# EAGLE design ADCModule (EAGLE 6.5.0)

## Sheet 1 of 3
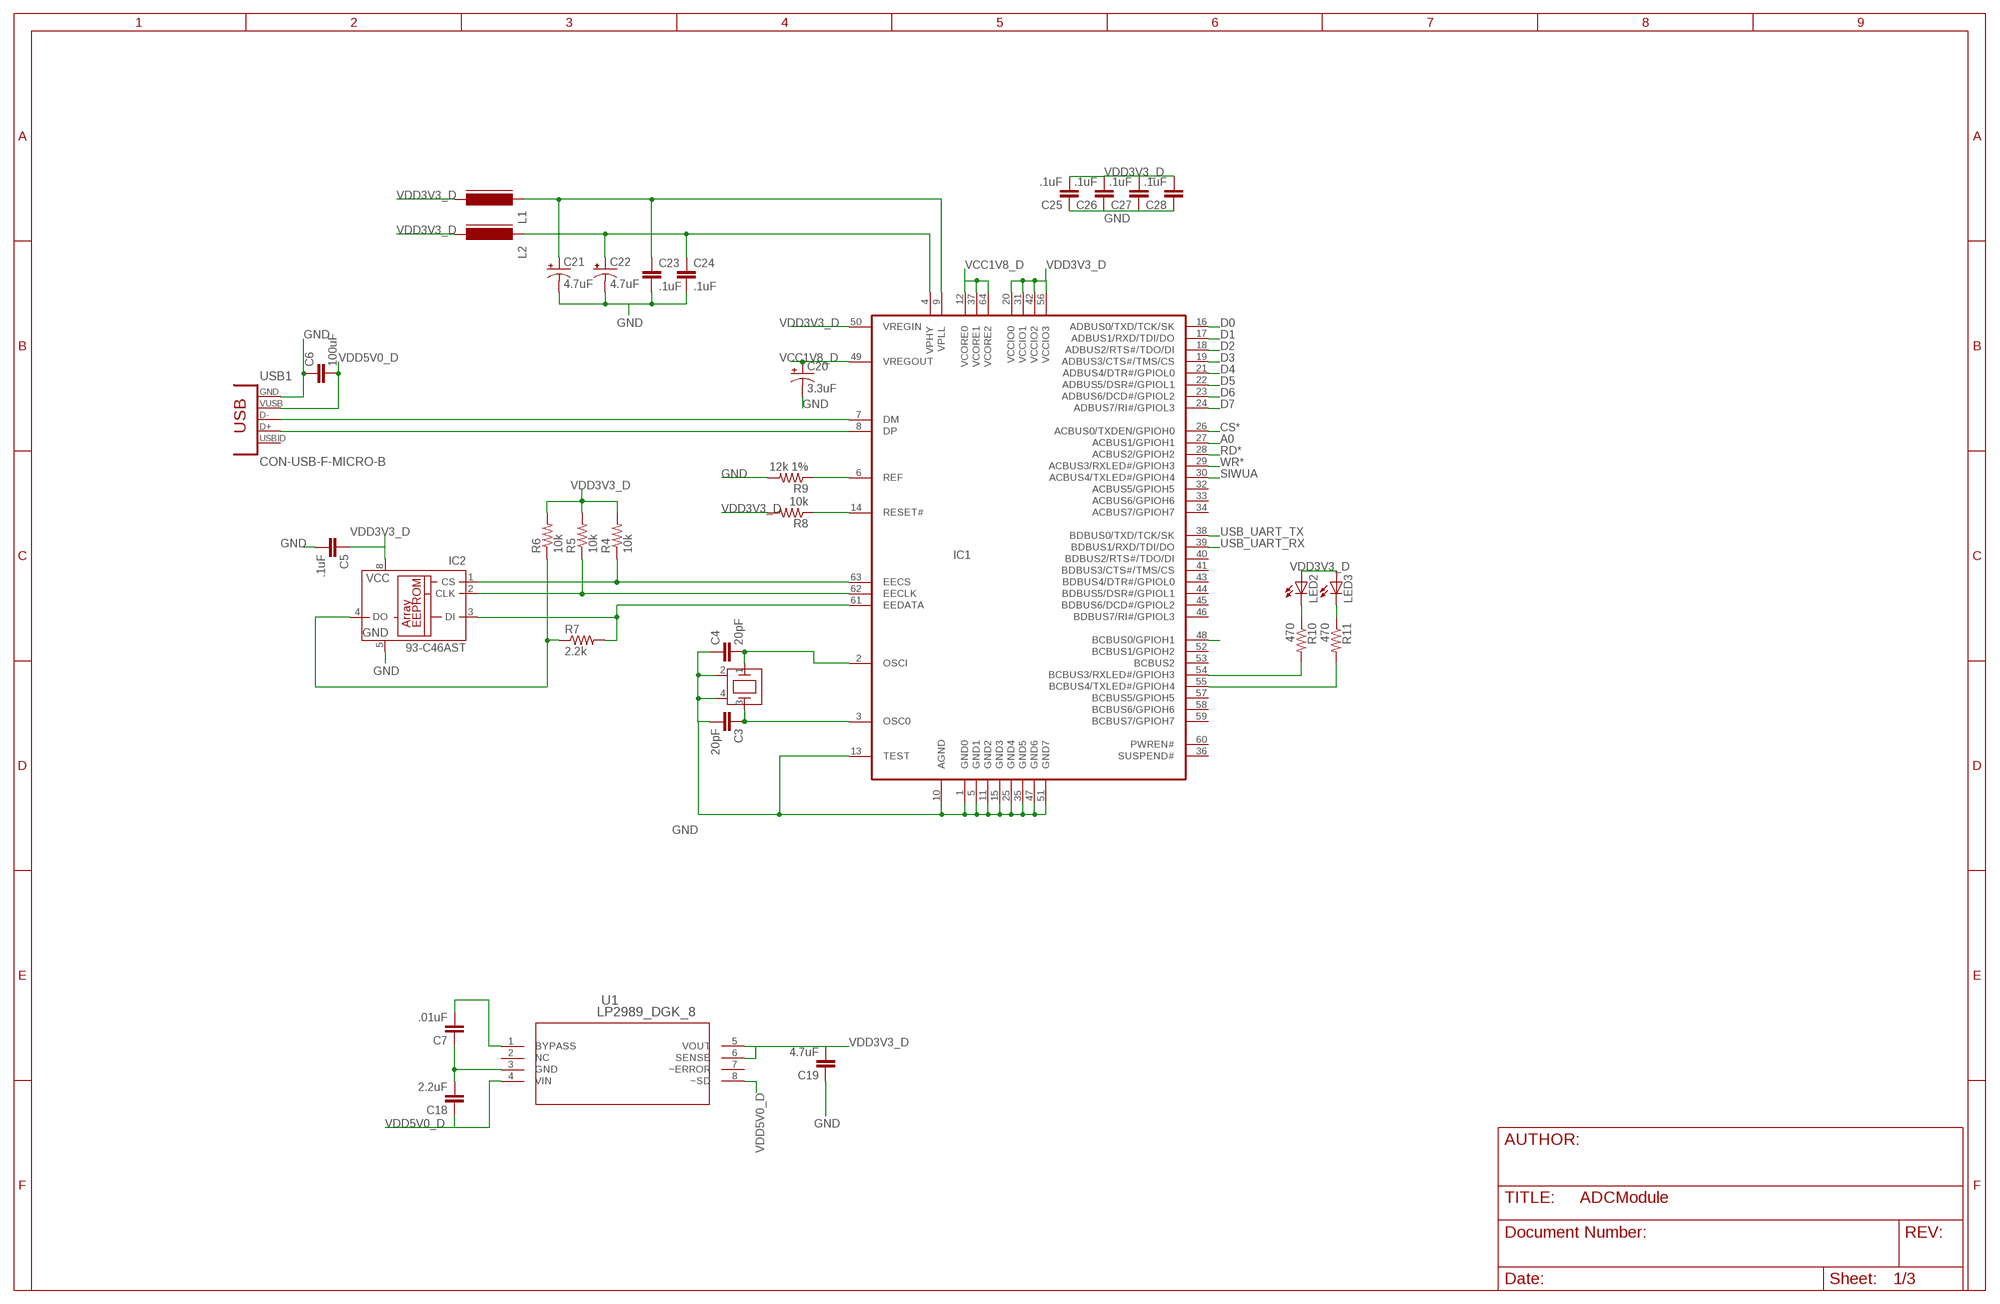
[diagram p0: schematic, sheet 1]

### Parts
C3  20pF  CAP0805  [0805]
C4  20pF  CAP0805  [0805]
C5  .1uF  CAP0805  [0805]
C6  100uF  CAP1206  [1206]
C7  .01uF  CAP0805  [0805]
C18  2.2uF  CAP0805  [0805]
C19  4.7uF  CAP0805  [0805]
C20  3.3uF  CAP_POL1206  [EIA3216]
C21  4.7uF  CAP_POL1206  [EIA3216]
C22  4.7uF  CAP_POL1206  [EIA3216]
C23  .1uF  CAP0805  [0805]
C24  .1uF  CAP0805  [0805]
C25  .1uF  CAP0805  [0805]
C26  .1uF  CAP0805  [0805]
C27  .1uF  CAP0805  [0805]
C28  .1uF  CAP0805  [0805]
IC1  IC_FT2232H  [LQFP64]
IC2  93-C46AST  [TSSOP8]
L1  FERRITE-0805  [FB805]
L2  FERRITE-0805  [FB805]
LED2  LEDCHIP-LED0805  [CHIP-LED0805]
LED3  LEDCHIP-LED0805  [CHIP-LED0805]
R4  10k  RESISTOR0805-RES  [0805]
R5  10k  RESISTOR0805-RES  [0805]
R6  10k  RESISTOR0805-RES  [0805]
R7  2.2k  RESISTOR0805-RES  [0805]
R8  10k  RESISTOR0805-RES  [0805]
R9  12k 1%  RESISTOR0805-RES  [0805]
R10  470  RESISTOR0805-RES  [0805]
R11  470  RESISTOR0805-RES  [0805]
U1  LP2989_DGK_8  [MUA08A]
U$3  7M-12.000MEEQ-T  [7M-CRYSTAL]
USB1  CON-USB-F-MICRO-B  [CONN_USB_MICRO-B]

### Nets
A0: IC1.27(ACBUS1/GPIOH1) ; also sheet 2
CS*: IC1.26(ACBUS0/TXDEN/GPIOH0) ; also sheet 2
D0: IC1.16(ADBUS0/TXD/TCK/SK) ; also sheet 2
D1: IC1.17(ADBUS1/RXD/TDI/DO) ; also sheet 2
D2: IC1.18(ADBUS2/RTS#/TDO/DI) ; also sheet 2
D3: IC1.19(ADBUS3/CTS#/TMS/CS) ; also sheet 2
D4: IC1.21(ADBUS4/DTR#/GPIOL0) ; also sheet 2
D5: IC1.22(ADBUS5/DSR#/GPIOL1) ; also sheet 2
D6: IC1.23(ADBUS6/DCD#/GPIOL2) ; also sheet 2
D7: IC1.24(ADBUS7/RI#/GPIOL3) ; also sheet 2
GND: C3.2 C4.1 C5.2 C6.1 C7.1 C18.2 C19.1 C20.C(-) C21.C(-) C22.C(-) C23.2 C24.2 C25.1 C26.1 C27.1 C28.1 IC1.1(GND0) IC1.5(GND1) IC1.10(AGND) IC1.11(GND2) IC1.13(TEST) IC1.15(GND3) IC1.25(GND4) IC1.35(GND5) IC1.47(GND6) IC1.51(GND7) IC2.5(GND) R9.2 U1.3(GND) U$3.2(GND1) U$3.4(GND2) USB1.P5(GND) ; also sheet 2
N$8: C3.1 IC1.3(OSC0) U$3.3(OSC2)
N$9: C4.2 IC1.2(OSCI) U$3.1(OSC1)
N$10: IC1.7(DM) USB1.P2(D-)
N$11: IC1.8(DP) USB1.P3(D+)
N$12: IC1.63(EECS) IC2.1(CS) R4.1
N$13: IC1.62(EECLK) IC2.2(CLK) R5.1
N$17: IC2.4(DO) R6.1 R7.1
N$18: IC1.61(EEDATA) IC2.3(DI) R7.2
N$19: IC1.14(RESET#) R8.1
N$20: IC1.6(REF) R9.1
N$21: C22.A(+) C24.1 IC1.4(VPHY) L2.1
N$22: C21.A(+) C23.1 IC1.9(VPLL) L1.1
N$23: C7.2 U1.1(BYPASS)
N$27: IC1.48(BCBUS0/GPIOH1)
N$28: IC1.54(BCBUS3/RXLED#/GPIOH3) R10.2
N$29: IC1.55(BCBUS4/TXLED#/GPIOH4) R11.2
N$32: LED2.C R10.1
N$33: LED3.C R11.1
RD*: IC1.28(ACBUS2/GPIOH2) ; also sheet 2
SIWUA: IC1.30(ACBUS4/TXLED#/GPIOH4)
USB_UART_RX: IC1.39(BDBUS1/RXD/TDI/DO) ; also sheet 2
USB_UART_TX: IC1.38(BDBUS0/TXD/TCK/SK) ; also sheet 2
VCC1V8_D: C20.A(+) IC1.12(VCORE0) IC1.37(VCORE1) IC1.49(VREGOUT) IC1.64(VCORE2)
VDD3V3_D: C5.1 C19.2 C25.2 C26.2 C27.2 C28.2 IC1.20(VCCIO0) IC1.31(VCCIO1) IC1.42(VCCIO2) IC1.50(VREGIN) IC1.56(VCCIO3) IC2.8(VCC) L1.2 L2.2 LED2.A LED3.A R4.2 R5.2 R6.2 R8.2 U1.5(VOUT) U1.6(SENSE) ; also sheet 2
VDD5V0_D: C6.2 C18.1 U1.4(VIN) U1.8(~SD) USB1.P1(VUSB) ; also sheet 2
WR*: IC1.29(ACBUS3/RXLED#/GPIOH3) ; also sheet 2
Unconnected: IC1.32(ACBUS5/GPIOH5) IC1.33(ACBUS6/GPIOH6) IC1.34(ACBUS7/GPIOH7) IC1.36(SUSPEND#) IC1.40(BDBUS2/RTS#/TDO/DI) IC1.41(BDBUS3/CTS#/TMS/CS) IC1.43(BDBUS4/DTR#/GPIOL0) IC1.44(BDBUS5/DSR#/GPIOL1) IC1.45(BDBUS6/DCD#/GPIOL2) IC1.46(BDBUS7/RI#/GPIOL3) IC1.52(BCBUS1/GPIOH2) IC1.53(BCBUS2) IC1.57(BCBUS5/GPIOH5) IC1.58(BCBUS6/GPIOH6) IC1.59(BCBUS7/GPIOH7) IC1.60(PWREN#) U1.2(NC) U1.7(~ERROR) USB1.BODY@1(BODY) USB1.BODY@2(BODY) USB1.BODY@3(BODY) USB1.BODY@4(BODY) USB1.P4(USBID)

## Sheet 2 of 3
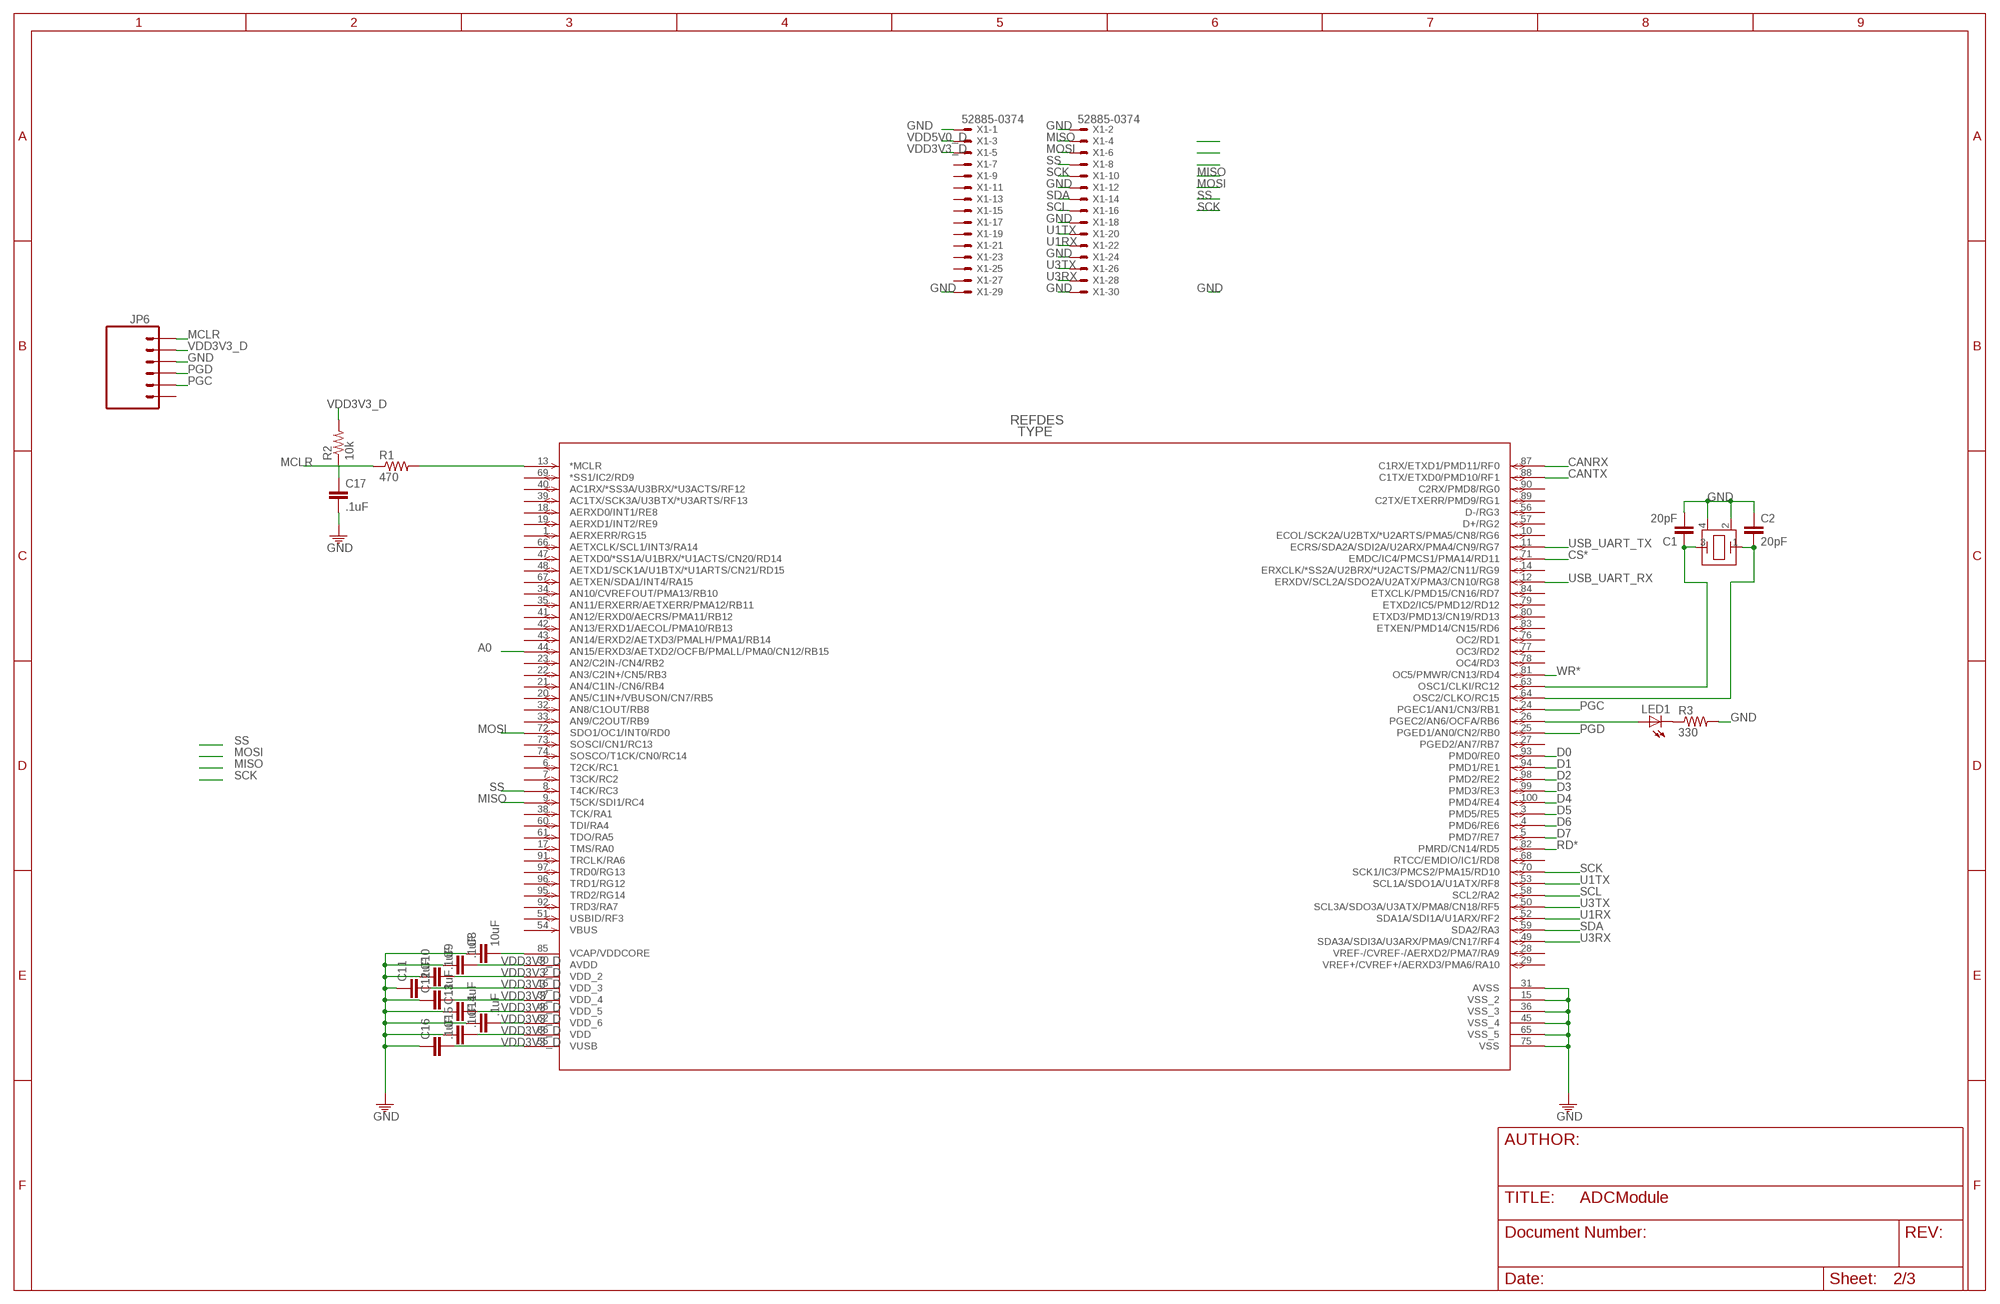
[diagram p1: schematic, sheet 2]

### Parts
C1  20pF  CAP0805  [0805]
C2  20pF  CAP0805  [0805]
C8  10uF  CAP0805  [0805]
C9  .1uF  CAP0805  [0805]
C10  .1uF  CAP0805  [0805]
C11  .1uF  CAP0805  [0805]
C12  .1uF  CAP0805  [0805]
C13  .1uF  CAP0805  [0805]
C14  .1uF  CAP0805  [0805]
C15  .1uF  CAP0805  [0805]
C16  .1uF  CAP0805  [0805]
C17  .1uF  CAP0805  [0805]
JP6  M06SIP_LOCK  [1X06-SIP_LOCK]
LED1  LED0805  [LED-0805]
R1  470  RESISTOR0805-RES  [0805]
R2  10k  RESISTOR0805-RES  [0805]
R3  330  RESISTOR0805-RES  [0805]
U$1  PIC32MX795F512L-  [TQFP100_12X12MC]
U$2  ABM3B-8.000MHZ-10-1-U-T  [ABM3B]
X1  52885-0374  [52885-0374]

### Nets
A0: U$1.44(AN15/ERXD3/AETXD2/OCFB/PMALL/PMA0/CN12/RB15) ; also sheet 1
CANRX: U$1.87(C1RX/ETXD1/PMD11/RF0)
CANTX: U$1.88(C1TX/ETXD0/PMD10/RF1)
CS*: U$1.71(EMDC/IC4/PMCS1/PMA14/RD11) ; also sheet 1
D0: U$1.93(PMD0/RE0) ; also sheet 1
D1: U$1.94(PMD1/RE1) ; also sheet 1
D2: U$1.98(PMD2/RE2) ; also sheet 1
D3: U$1.99(PMD3/RE3) ; also sheet 1
D4: U$1.100(PMD4/RE4) ; also sheet 1
D5: U$1.3(PMD5/RE5) ; also sheet 1
D6: U$1.4(PMD6/RE6) ; also sheet 1
D7: U$1.5(PMD7/RE7) ; also sheet 1
GND: C1.2 C2.1 C8.1 C9.1 C10.1 C11.1 C12.1 C13.1 C14.1 C15.1 C16.1 C17.2 JP6.3 R3.2 U$1.15(VSS_2) U$1.31(AVSS) U$1.36(VSS_3) U$1.45(VSS_4) U$1.65(VSS_5) U$1.75(VSS) U$2.2(GND1) U$2.4(GND2) X1.1 X1.2 X1.12 X1.18 X1.24 X1.29 X1.30 ; also sheet 1
MCLR: C17.1 JP6.1 R1.1 R2.1
MISO: U$1.9(T5CK/SDI1/RC4) X1.4
MOSI: U$1.72(SDO1/OC1/INT0/RD0) X1.6
N$1: C1.1 U$1.63(OSC1/CLKI/RC12) U$2.3(OSC2)
N$2: C2.2 U$1.64(OSC2/CLKO/RC15) U$2.1(OSC1)
N$4: C8.2 U$1.85(VCAP/VDDCORE)
N$14: R1.2 U$1.13(*MCLR)
N$15: LED1.1(A) U$1.26(PGEC2/AN6/OCFA/RB6)
N$16: LED1.2(C) R3.1
PGC: JP6.5 U$1.24(PGEC1/AN1/CN3/RB1)
PGD: JP6.4 U$1.25(PGED1/AN0/CN2/RB0)
RD*: U$1.82(PMRD/CN14/RD5) ; also sheet 1
SCK: U$1.70(SCK1/IC3/PMCS2/PMA15/RD10) X1.10
SCL: U$1.58(SCL2/RA2) X1.16
SDA: U$1.59(SDA2/RA3) X1.14
SS: U$1.8(T4CK/RC3) X1.8
U1RX: U$1.52(SDA1A/SDI1A/U1ARX/RF2) X1.22
U1TX: U$1.53(SCL1A/SDO1A/U1ATX/RF8) X1.20
U3RX: U$1.49(SDA3A/SDI3A/U3ARX/PMA9/CN17/RF4) X1.28
U3TX: U$1.50(SCL3A/SDO3A/U3ATX/PMA8/CN18/RF5) X1.26
USB_UART_RX: U$1.12(ERXDV/SCL2A/SDO2A/U2ATX/PMA3/CN10/RG8) ; also sheet 1
USB_UART_TX: U$1.11(ECRS/SDA2A/SDI2A/U2ARX/PMA4/CN9/RG7) ; also sheet 1
VDD3V3_D: C9.2 C10.2 C11.2 C12.2 C13.2 C14.2 C15.2 C16.2 JP6.2 R2.2 U$1.2(VDD_2) U$1.16(VDD_3) U$1.30(AVDD) U$1.37(VDD_4) U$1.46(VDD_5) U$1.55(VUSB) U$1.62(VDD_6) U$1.86(VDD) X1.5 ; also sheet 1
VDD5V0_D: X1.3 ; also sheet 1
WR*: U$1.81(OC5/PMWR/CN13/RD4) ; also sheet 1
Unconnected: JP6.6 U$1.1(AERXERR/RG15) U$1.6(T2CK/RC1) U$1.7(T3CK/RC2) U$1.10(ECOL/SCK2A/U2BTX/*U2ARTS/PMA5/CN8/RG6) U$1.14(ERXCLK/*SS2A/U2BRX/*U2ACTS/PMA2/CN11/RG9) U$1.17(TMS/RA0) U$1.18(AERXD0/INT1/RE8) U$1.19(AERXD1/INT2/RE9) U$1.20(AN5/C1IN+/VBUSON/CN7/RB5) U$1.21(AN4/C1IN-/CN6/RB4) U$1.22(AN3/C2IN+/CN5/RB3) U$1.23(AN2/C2IN-/CN4/RB2) U$1.27(PGED2/AN7/RB7) U$1.28(VREF-/CVREF-/AERXD2/PMA7/RA9) U$1.29(VREF+/CVREF+/AERXD3/PMA6/RA10) U$1.32(AN8/C1OUT/RB8) U$1.33(AN9/C2OUT/RB9) U$1.34(AN10/CVREFOUT/PMA13/RB10) U$1.35(AN11/ERXERR/AETXERR/PMA12/RB11) U$1.38(TCK/RA1) U$1.39(AC1TX/SCK3A/U3BTX/*U3ARTS/RF13) U$1.40(AC1RX/*SS3A/U3BRX/*U3ACTS/RF12) U$1.41(AN12/ERXD0/AECRS/PMA11/RB12) U$1.42(AN13/ERXD1/AECOL/PMA10/RB13) U$1.43(AN14/ERXD2/AETXD3/PMALH/PMA1/RB14) U$1.47(AETXD0/*SS1A/U1BRX/*U1ACTS/CN20/RD14) U$1.48(AETXD1/SCK1A/U1BTX/*U1ARTS/CN21/RD15) U$1.51(USBID/RF3) U$1.54(VBUS) U$1.56(D-/RG3) U$1.57(D+/RG2) U$1.60(TDI/RA4) U$1.61(TDO/RA5) U$1.66(AETXCLK/SCL1/INT3/RA14) U$1.67(AETXEN/SDA1/INT4/RA15) U$1.68(RTCC/EMDIO/IC1/RD8) U$1.69(*SS1/IC2/RD9) U$1.73(SOSCI/CN1/RC13) U$1.74(SOSCO/T1CK/CN0/RC14) U$1.76(OC2/RD1) U$1.77(OC3/RD2) U$1.78(OC4/RD3) U$1.79(ETXD2/IC5/PMD12/RD12) U$1.80(ETXD3/PMD13/CN19/RD13) U$1.83(ETXEN/PMD14/CN15/RD6) U$1.84(ETXCLK/PMD15/CN16/RD7) U$1.89(C2TX/ETXERR/PMD9/RG1) U$1.90(C2RX/PMD8/RG0) U$1.91(TRCLK/RA6) U$1.92(TRD3/RA7) U$1.95(TRD2/RG14) U$1.96(TRD1/RG12) U$1.97(TRD0/RG13) X1.7 X1.9 X1.11 X1.13 X1.15 X1.17 X1.19 X1.21 X1.23 X1.25 X1.27

## Sheet 3 of 3
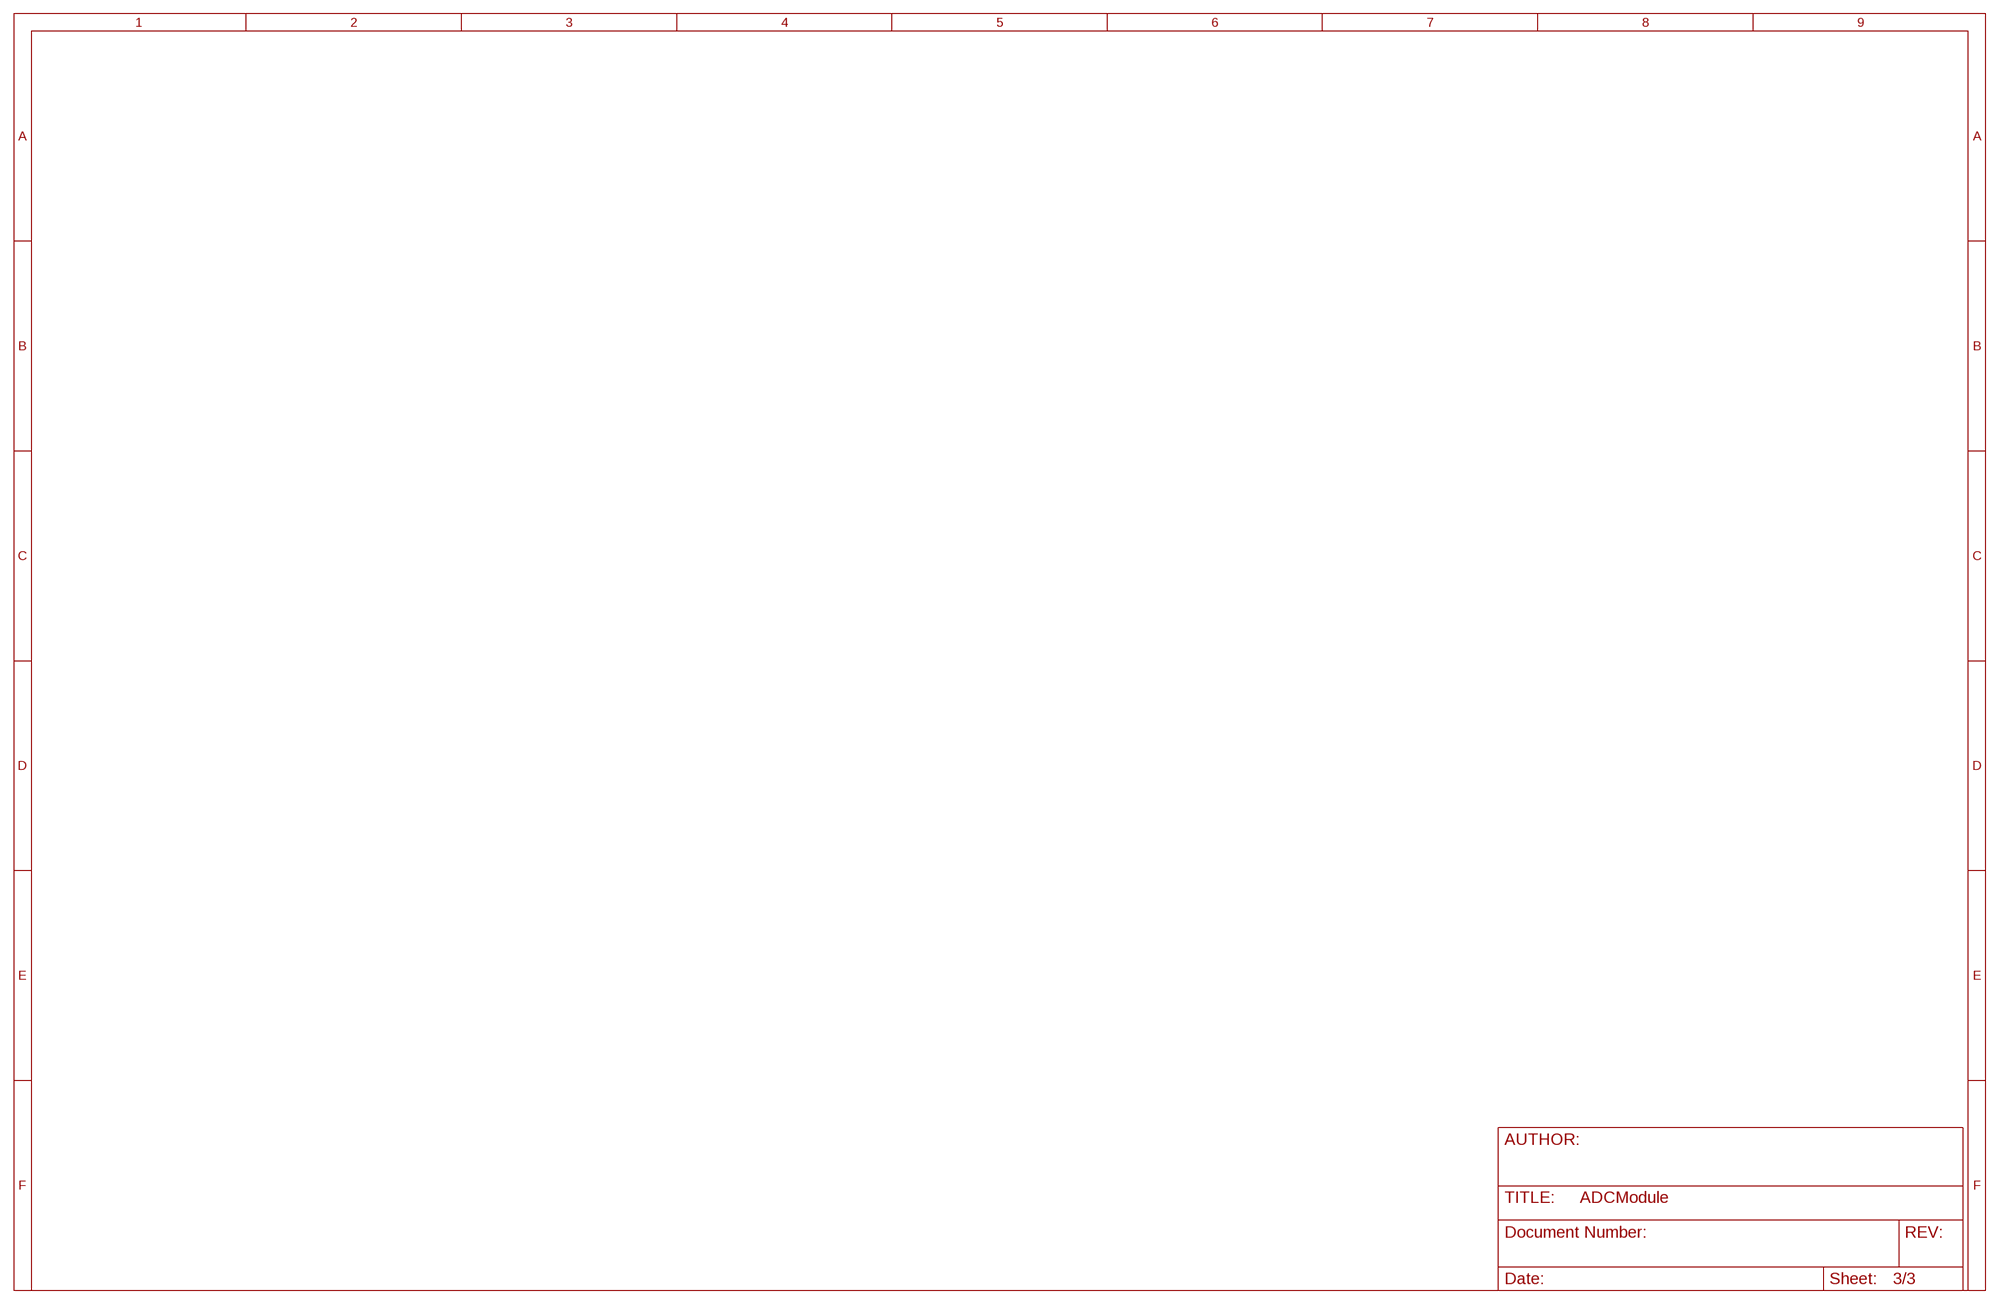
[diagram p2: schematic, sheet 3]

## Library data of the parts
C1-C19 C23-C28 = SensorCape:CAP: Capacitor Standard 0603 ceramic capacitor, and 0.1" leaded capacitor.
C20-C22 = SensorCape:CAP_POL: Capacitor Polarized These are standard SMD and PTH capacitors. Normally 10uF, 47uF, and 100uF in electrolytic and tantalum varieties. Always verify the external diameter of the through hole cap, it varies with capacity, voltage, and manufacturer. The EIA devices should be standard.
IC1 = SensorCape:IC_FT2232H: DUAL HIGH SPEED USB TO MULTIPURPOSE UART/FIFO IC
IC2 = microchip:93-*: Serial EEPROM 512 x 8 bit/256 x 16 bit/1 K/4 K, 5.0 V, Microwire; MPN: CAT93C46YI-G; OC_FARNELL: 1718375; OC_NEWARK: 74P0100
JP6 = ASL:M06: Header 6 Standard 6-pin 0.1" header. Use with straight break away headers (SKU : PRT-00116), right angle break away headers (PRT-00553), swiss pins (PRT-00743), machine pins (PRT-00117), and female headers (PRT-00115). Molex polarized connector foot print use with SKU : PRT-08094 with associated crimp pins and housings. NOTES ON THE VARIANTS LOCK and LOCK_LONGPADS... This footprint was designed to help hold the alignment of a through-hole component (i.e. 6-pin header) while soldering it into place. You may notice that each hole has been shifted either up or down by 0.005 of an inch from it's more standard position (which is a perfectly straight line). This slight alteration caused the pins (the squares in the middle) to touch the edges of the holes. Because they are alternating, it causes a "brace" to hold the component in place. 0.005 has proven to be the perfect amount of "off-center" position when using our standard breakaway headers. Although looks a little odd when you look at the bare footprint, once you have a header in there, the alteration is very hard to notice. Also, if you push a header all the way into place, it is covered up entirely on the bottom side. This idea of altering the position of holes to aid alignment will be further integrated into the Sparkfun Library for other footprints. It can help hold any component with 3 or more connection pins.
L1 L2 = dp_devices.v6:FERRITE: Ferrite bead in various packages
LED1 = ASL:LED: LEDs Standard schematic elements and footprints for 5mm, 3mm, 1206, and 0603 sized LEDs. 5mm - Spark Fun Electronics SKU : COM-00529 (and others)
LED2 LED3 = led:LED: LED OSRAM: - CHIPLED LG R971, LG N971, LY N971, LG Q971, LY Q971, LO R971, LY R971 LH N974, LH R974 LS Q976, LO Q976, LY Q976 LO Q996 - Hyper CHIPLED LW Q18S LB Q993, LB Q99A, LB R99A - SideLED LS A670, LO A670, LY A670, LG A670, LP A670 LB A673, LV A673, LT A673, LW A673 LH A674 LY A675 LS A676, LA A676, LO A676, LY A676, LW A676 LS A679, LY A679, LG A679 - Hyper Micro SIDELED® LS Y876, LA Y876, LO Y876, LY Y876 LT Y87S - SmartLED LW L88C, LW L88S LB L89C, LB L89S, LG L890 LS L89K, LO L89K, LY L89K LS L896, LA L896, LO L896, LY L896 - TOPLED LS T670, LO T670, LY T670, LG T670, LP T670 LSG T670, LSP T670, LSY T670, LOP T670, LYG T670 LG T671, LOG T671, LSG T671 LB T673, LV T673, LT T673, LW T673 LH T674 LS T676, LA T676, LO T676, LY T676, LB T676, LH T676, LSB T676, LW T676 LB T67C, LV T67C, LT T67C, LS T67K, LO T67K, LY T67K, LW E67C LS E67B, LA E67B, LO E67B, LY E67B, LB E67C, LV E67C, LT E67C LW T67C LS T679, LY T679, LG T679 LS T770, LO T770, LY T770, LG T770, LP T770 LB T773, LV T773, LT T773, LW T773 LH T774 LS E675, LA E675, LY E675, LS T675 LS T776, LA T776, LO T776, LY T776, LB T776 LHGB T686 LT T68C, LB T68C - Hyper Mini TOPLED® LB M676 - Mini TOPLED Santana® LG M470 LS M47K, LO M47K, LY M47K Source: http://www.osram.convergy.de LUXEON: - LUMILED® LXK2-PW12-R00, LXK2-PW12-S00, LXK2-PW14-U00, LXK2-PW14-V00 LXK2-PM12-R00, LXK2-PM12-S00, LXK2-PM14-U00 LXK2-PE12-Q00, LXK2-PE12-R00, LXK2-PE12-S00, LXK2-PE14-T00, LXK2-PE14-U00 LXK2-PB12-K00, LXK2-PB12-L00, LXK2-PB12-M00, LXK2-PB14-N00, LXK2-PB14-P00, LXK2-PB14-Q00 LXK2-PR12-L00, LXK2-PR12-M00, LXK2-PR14-Q00, LXK2-PR14-R00 LXK2-PD12-Q00, LXK2-PD12-R00, LXK2-PD12-S00 LXK2-PH12-R00, LXK2-PH12-S00 LXK2-PL12-P00, LXK2-PL12-Q00, LXK2-PL12-R00 Source: www.luxeon.com KINGBRIGHT: KA-3528ASYC Source: www.kingbright.com
R1-R11 = SensorCape:RESISTOR: Resistor Basic schematic elements and footprints for 0603, 1206, and PTH resistors.
U1 = SensorCape:LP2989_DGK_8; BASE_PN: LP2989; COMP: TypeLDO; LIBRARY: ReferenceLP2989AIMM; PARTNUMBER: LP2989AIMM-25; PIN: Count8; SYMBOL: NameLP2989AIMM-25; TYPE: LP2989AIMM-2.5; VENDOR: NationalSemiconductor; VERSION: 1
U$1 = SensorCape:PIC32MX795F512L-
U$2 = SensorCape:ABM3B-8.000MHZ-10-1-U-T
U$3 = SensorCape:7M-12.000MEEQ-T
USB1 = dp_devices.v6:CON-USB-F: USB Female connector
X1 = SensorCape:52885-0374: MOLEX Connector SD-52760-**79 Source: 52760-1079_sd molex.pdf; MPN: 52760-0379; OC_FARNELL: unknown; OC_NEWARK: 92M6431

## Board
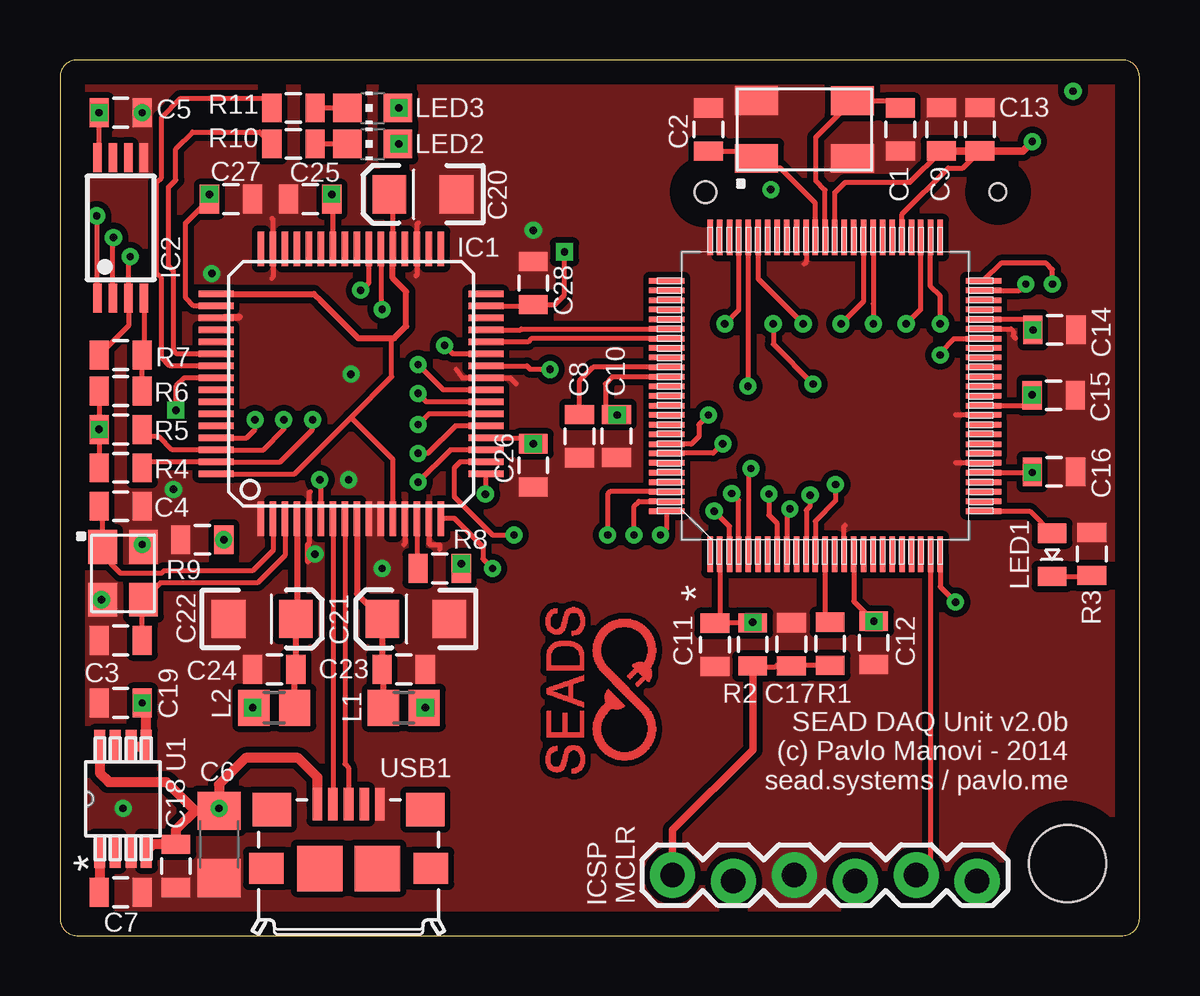
[diagram p3: board, top side]
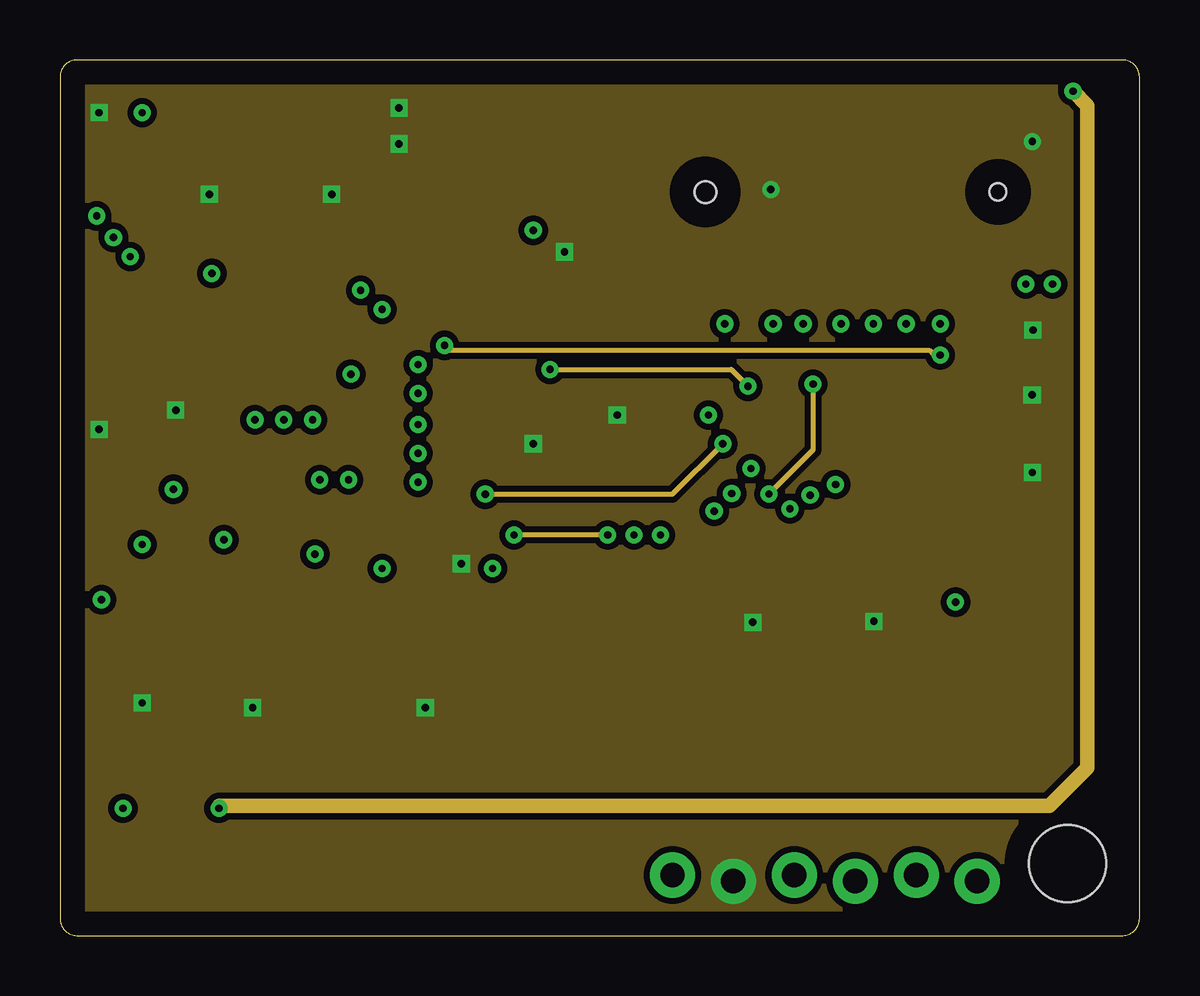
[diagram p4: board, inner layer Route14]
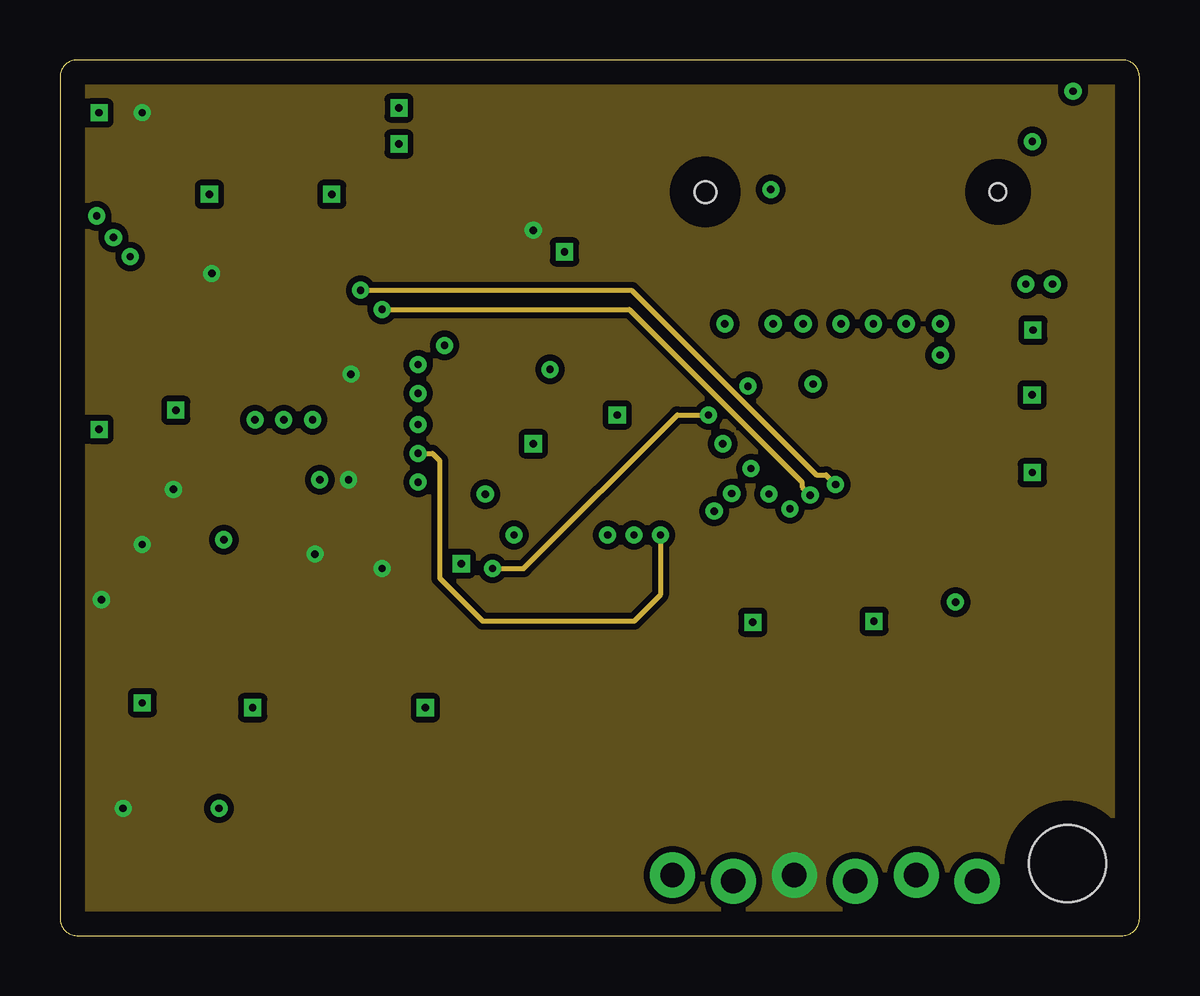
[diagram p5: board, inner layer Route15]
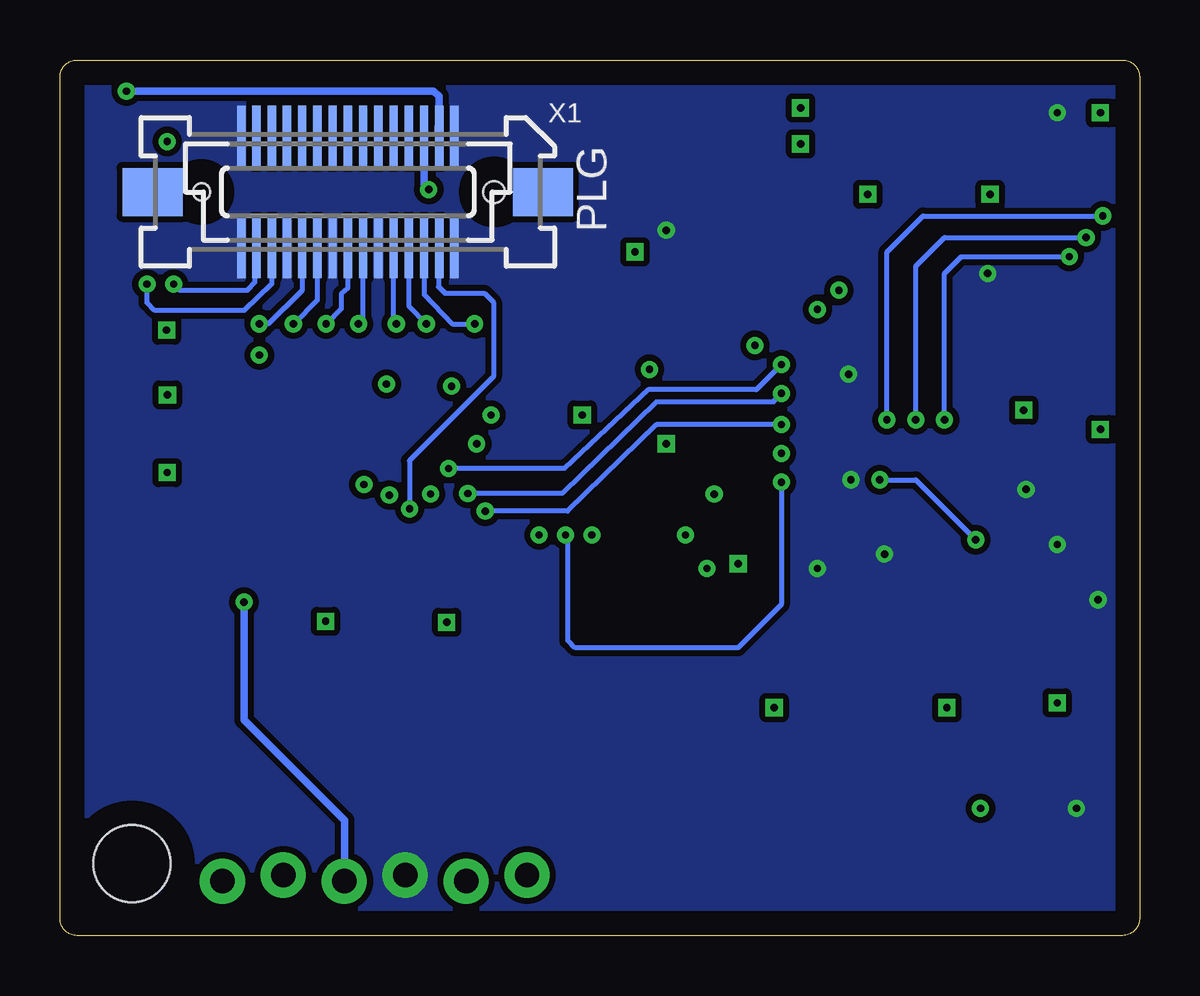
[diagram p6: board, bottom side, seen from below]

Size 45 x 36.5 mm. Coordinates in mm from the lower left corner, seen from the top.
Outline: 0.71,0 44.29,0 arc90 45,0.71 45,35.79 arc90 44.29,36.5 0.71,36.5 arc90 0,35.79 0,0.71 arc90 0.71,0
Copper layers (1*14+15*16): Top 0.035mm / dielectric 1.5mm / Route14 0.035mm / dielectric 0.15mm / Route15 0.035mm / dielectric 0.2mm / Bottom 0.035mm
Design rules "default *": minimum track width 10mil, minimum drill 24mil, track to track 8mil, track to pad 8mil, pad to pad 8mil, via to via 8mil, smd to smd 8mil, copper to edge 40mil, drill to drill 8mil, minimum pad ring 10mil, minimum via ring 8mil, stop-mask expansion 4mil, vias tented up to drill 0mil, thermal gap 10mil
Holes 3.2 mm at 42,3

### Footprints (pad centres in the part's own frame; a part is rotated, then mirrored left to right if it is on the bottom)
0805 = smd 0.8 x 1.2: 1 -0.9,0; 2 0.9,0
1206 = smd 1.6 x 1.8: 1 -1.4,0; 2 1.4,0
EIA3216 = smd 1.4 x 1.6: A 1.4,0; C -1.4,0
LQFP64 = smd 1.45 x 0.27: 1 -5.625,3.75; 2 -5.625,3.25; 3 -5.625,2.75; 4 -5.625,2.25; 5 -5.625,1.75; 6 -5.625,1.25; 7 -5.625,0.75; 8 -5.625,0.25; 9 -5.625,-0.25; 10 -5.625,-0.75; 11 -5.625,-1.25; 12 -5.625,-1.75; 13 -5.625,-2.25; 14 -5.625,-2.75; 15 -5.625,-3.25; 16 -5.625,-3.75; 33 5.625,-3.75; 34 5.625,-3.25; 35 5.625,-2.75; 36 5.625,-2.25; 37 5.625,-1.75; 38 5.625,-1.25; 39 5.625,-0.75; 40 5.625,-0.25; 41 5.625,0.25; 42 5.625,0.75; 43 5.625,1.25; 44 5.625,1.75; 45 5.625,2.25; 46 5.625,2.75; 47 5.625,3.25; 48 5.625,3.75 | smd 0.27 x 1.45: 17 -3.75,-5.625; 18 -3.25,-5.625; 19 -2.75,-5.625; 20 -2.25,-5.625; 21 -1.75,-5.625; 22 -1.25,-5.625; 23 -0.75,-5.625; 24 -0.25,-5.625; 25 0.25,-5.625; 26 0.75,-5.625; 27 1.25,-5.625; 28 1.75,-5.625; 29 2.25,-5.625; 30 2.75,-5.625; 31 3.25,-5.625; 32 3.75,-5.625; 49 3.75,5.625; 50 3.25,5.625; 51 2.75,5.625; 52 2.25,5.625; 53 1.75,5.625; 54 1.25,5.625; 55 0.75,5.625; 56 0.25,5.625; 57 -0.25,5.625; 58 -0.75,5.625; 59 -1.25,5.625; 60 -1.75,5.625; 61 -2.25,5.625; 62 -2.75,5.625; 63 -3.25,5.625; 64 -3.75,5.625
TSSOP8 = smd 0.35 x 1.2: 1 -0.975,-2.925; 2 -0.325,-2.925; 3 0.325,-2.925; 4 0.975,-2.925; 5 0.975,2.925; 6 0.325,2.925; 7 -0.325,2.925; 8 -0.975,2.925
1X06-SIP_LOCK = drill 1.016 pad 1.88: 1 0,0; 2 2.54,-0.254; 3 5.08,0; 4 7.62,-0.254; 5 10.16,0; 6 12.7,-0.254
FB805 = smd 1.3 x 1.5: 1 -0.85,0; 2 0.85,0
LED-0805 = smd 0.8 x 1.2: 1 -0.9,0; 2 0.9,0
CHIP-LED0805 = smd 1.2 x 1.2: A 0,-1.05; C 0,1.05
MUA08A = smd 1.372 x 0.457: 1 -2.184,0.965; 2 -2.184,0.33; 3 -2.184,-0.33; 4 -2.184,-0.965; 5 2.184,-0.965; 6 2.184,-0.33; 7 2.184,0.33; 8 2.184,0.965
TQFP100_12X12MC = smd 1.473 x 0.229: 1 -6.604,4.801; 2 -6.604,4.394; 3 -6.604,3.988; 4 -6.604,3.607; 5 -6.604,3.2; 6 -6.604,2.794; 7 -6.604,2.388; 8 -6.604,2.007; 9 -6.604,1.6; 10 -6.604,1.194; 11 -6.604,0.787; 12 -6.604,0.406; 13 -6.604,0; 14 -6.604,-0.406; 15 -6.604,-0.787; 16 -6.604,-1.194; 17 -6.604,-1.6; 18 -6.604,-2.007; 19 -6.604,-2.388; 20 -6.604,-2.794; 21 -6.604,-3.2; 22 -6.604,-3.607; 23 -6.604,-3.988; 24 -6.604,-4.394; 25 -6.604,-4.801; 51 6.604,-4.801; 52 6.604,-4.394; 53 6.604,-3.988; 54 6.604,-3.607; 55 6.604,-3.2; 56 6.604,-2.794; 57 6.604,-2.388; 58 6.604,-2.007; 59 6.604,-1.6; 60 6.604,-1.194; 61 6.604,-0.787; 62 6.604,-0.406; 63 6.604,0; 64 6.604,0.406; 65 6.604,0.787; 66 6.604,1.194; 67 6.604,1.6; 68 6.604,2.007; 69 6.604,2.388; 70 6.604,2.794; 71 6.604,3.2; 72 6.604,3.607; 73 6.604,3.988; 74 6.604,4.394; 75 6.604,4.801 | smd 0.229 x 1.473: 26 -4.801,-6.604; 27 -4.394,-6.604; 28 -3.988,-6.604; 29 -3.607,-6.604; 30 -3.2,-6.604; 31 -2.794,-6.604; 32 -2.388,-6.604; 33 -2.007,-6.604; 34 -1.6,-6.604; 35 -1.194,-6.604; 36 -0.787,-6.604; 37 -0.406,-6.604; 38 0,-6.604; 39 0.406,-6.604; 40 0.787,-6.604; 41 1.194,-6.604; 42 1.6,-6.604; 43 2.007,-6.604; 44 2.388,-6.604; 45 2.794,-6.604; 46 3.2,-6.604; 47 3.607,-6.604; 48 3.988,-6.604; 49 4.394,-6.604; 50 4.801,-6.604; 76 4.801,6.604; 77 4.394,6.604; 78 3.988,6.604; 79 3.607,6.604; 80 3.2,6.604; 81 2.794,6.604; 82 2.388,6.604; 83 2.007,6.604; 84 1.6,6.604; 85 1.194,6.604; 86 0.787,6.604; 87 0.406,6.604; 88 0,6.604; 89 -0.406,6.604; 90 -0.787,6.604; 91 -1.194,6.604; 92 -1.6,6.604; 93 -2.007,6.604; 94 -2.388,6.604; 95 -2.794,6.604; 96 -3.2,6.604; 97 -3.607,6.604; 98 -3.988,6.604; 99 -4.394,6.604; 100 -4.801,6.604
ABM3B = smd 1.8 x 1.2: 1 -2,-1.2; 2 2,-1.2; 3 2,1.2; 4 -2,1.2
7M-CRYSTAL = smd 1.4 x 1.2: 1 -1.1,-0.85; 2 1.1,-0.85; 3 1.1,0.85; 4 -1.1,0.85
CONN_USB_MICRO-B = smd 1.6 x 1.4: BODY@1 -3.2,2.45; BODY@2 3.2,2.45 | smd 1.45 x 1.3: BODY@3 3.425,0; BODY@6 -3.425,0 | smd 1.9 x 1.9: BODY@4 1.2,0; BODY@5 -1.2,0 | smd 0.4 x 1.35: P1 -1.3,2.675; P2 -0.65,2.675; P3 0,2.675; P4 0.65,2.675; P5 1.3,2.675
52885-0374 = smd 0.35 x 2.5: 1 -4.445,-2.35; 2 -4.445,2.35; 3 -3.81,-2.35; 4 -3.81,2.35; 5 -3.175,-2.35; 6 -3.175,2.35; 7 -2.54,-2.35; 8 -2.54,2.35; 9 -1.905,-2.35; 10 -1.905,2.35; 11 -1.27,-2.35; 12 -1.27,2.35; 13 -0.635,-2.35; 14 -0.635,2.35; 15 0,-2.35; 16 0,2.35; 17 0.635,-2.35; 18 0.635,2.35; 19 1.27,-2.35; 20 1.27,2.35; 21 1.905,-2.35; 22 1.905,2.35; 23 2.54,-2.35; 24 2.54,2.35; 25 3.175,-2.35; 26 3.175,2.35; 27 3.81,-2.35; 28 3.81,2.35; 29 4.445,-2.35; 30 4.445,2.35 | smd 2.5 x 2: M1 -8.137,0; M2 8.137,0 | hole 0.9: -6.098,0 | hole 0.7: 6.098,0

### Placement (x,y rotation side)
C1  35.03,33.6 270 top
C2  27.03,33.6 270 top
C3  2.53,12.3 180 top
C4  2.53,17.9 180 top
C5  2.53,34.3 0 top
C6  6.63,3.8 90 top
C7  2.53,1.8 180 top
C8  21.66,20.82 90 top
C9  36.74,33.61 270 top
C10  23.2,20.82 90 top
C11  27.3,12.12 90 top
C12  33.92,12.2 90 top
C13  38.34,33.61 270 top
C14  41.46,25.25 180 top
C15  41.42,22.52 180 top
C16  41.43,19.33 180 top
C17  30.48,12.14 90 top
C18  4.83,2.9 270 top
C19  2.53,9.7 0 top
C20  15.13,30.9 180 top
C21  14.83,13.2 180 top
C22  8.43,13.2 0 top
C23  14.33,11.1 0 top
C24  8.93,11.1 180 top
C25  10.43,30.7 0 top
C26  19.73,19.6 90 top
C27  7.13,30.7 180 top
C28  19.73,27.2 270 top
IC1  12.13,23 90 top
IC2  2.53,29.5 0 top
JP6  25.53,2.52 0 top
L1  14.33,9.5 0 top
L2  8.93,9.5 180 top
LED1  41.35,15.87 270 top
LED2  13.03,33 90 top
LED3  13.03,34.5 90 top
R1  32.1,12.16 90 top
R2  28.88,12.13 90 top
R3  43.01,15.9 90 top
R4  2.53,19.5 180 top
R5  2.53,21.1 180 top
R6  2.53,22.7 180 top
R7  2.53,24.2 180 top
R8  15.83,15.3 0 top
R9  5.93,16.5 180 top
R10  9.73,33 180 top
R11  9.73,34.5 180 top
U1  2.63,5.7 90 top
U$1  31.89,22.5 90 top
U$2  31.03,33.6 0 top
U$3  2.63,15.1 270 top
USB1  12.03,2.8 0 top
X1  33,31 180 bottom

### Tracks (layer width: path | path; a pad name or v marks a point on that pad's centre or on a via)
A0  (via drill 0.3)
  Top 0.203: IC1.27 16.38,24.25 v16.03,24.6 | U$1.44 37.26,24.88 36.69,24.31 v36.69,24.2
  Route14 0.203: v16.03,24.6 16.23,24.4 36.23,24.4 36.43,24.2 v36.69,24.2
CS*  (via drill 0.3)
  Top 0.203: IC1.26 19.46,23.75 19.61,23.6 v20.43,23.6 | U$1.71 28.68,29.08 v28.68,22.9
  Route14 0.203: v20.43,23.6 27.98,23.6 v28.68,22.9
D0  (via drill 0.3)
  Top 0.203: IC1.16 15.9,17.4 16.43,17.4 17.63,16.2 17.63,15.7 v18.03,15.3 | v27.03,21.7 26.63,21.3 26.63,20.8 26.32,20.49 U$1.93
  Route15 0.203: 27.03,21.6 v27.03,21.7 25.73,21.7 19.33,15.3 v18.03,15.3
D1  (via drill 0.3)
  Top 0.203: v17.73,18.4 17.75,18.43 IC1.17 | v27.63,20.5 27.24,20.11 U$1.94
  Route14 0.203: v17.73,18.4 25.53,18.4 v27.63,20.5
D2  (via drill 0.3)
  Top 0.203: U$1.98 22.94,18.51 22.83,18.4 v22.83,16.7 | IC1.18 16.68,19.75 16.43,19.5 16.43,18.3 18.03,16.7 v18.93,16.7
  Route14 0.203: v22.83,16.7 v18.93,16.7
D3  (via drill 0.3)
  Top 0.203: IC1.19 16.28,20.25 v14.93,18.9 | v23.93,16.7 23.93,17.9 24.13,18.1 U$1.99
  Bottom 0.203: v14.93,18.9 14.93,13.8 16.73,12 23.53,12 23.83,12.3 23.83,16.6 v23.93,16.7
D4  (via drill 0.3)
  Top 0.203: IC1.21 16.48,21.25 15.33,20.1 v14.93,20.1 | U$1.100 25.29,16.96 v25.03,16.7
  Route15 0.203: v25.03,16.7 25.03,14.2 23.93,13.1 17.63,13.1 15.83,14.9 15.83,19.8 15.53,20.1 v14.93,20.1
D5  (via drill 0.3)
  Top 0.203: IC1.22 15.38,21.75 v14.93,21.3 | U$1.3 27.91,17.05 v27.27,17.69
  Bottom 0.203: v27.27,17.69 23.84,17.69 20.13,21.3 v14.93,21.3
D6  (via drill 0.3)
  Top 0.203: IC1.23 15.28,22.25 v14.93,22.6 | U$1.4 28.29,18.14 v28,18.43
  Bottom 0.203: v28,18.43 24.06,18.43 20.14,22.25 15.28,22.25 v14.93,22.6
D7  (via drill 0.3)
  Top 0.203: IC1.24 15.98,22.75 v14.93,23.8 | v28.8,19.47 28.7,19.46 U$1.5
  Bottom 0.203: v28.8,19.47 23.96,19.47 20.47,22.76 15.97,22.76 v14.93,23.8
GND  (via drill 0.3)
  Top 0.203: 14.93,29.7 14.88,29.65 IC1.35 14.88,27.55 14.83,27.5 | 8.83,29.9 8.88,29.85 IC1.47 8.88,27.45 8.83,27.4 | 10.43,18.5 10.38,18.45 IC1.5 10.38,16.35 10.33,16.3 | IC1.15 15.38,16.35 15.43,16.3 15.83,16.3 15.83,16.1 | 16.53,23.6 16.78,23.25 IC1.25 18.78,23.25 19.03,23 | IC1.51 7.48,25.75 7.53,25.8 6.83,25.8 | U$1.65 31.11,28.08 31.03,28 | U$1.15 32.68,17.05 32.73,17.1 | U$1.31 37.33,19.7 | U$1.36 37.34,21.71 37.33,21.7 | U$1.45 39.64,25.29 39.73,25.2 39.73,25 39.83,24.9 | IC1.13 14.38,16.35 14.33,16.3
  Top 0.254: 10.33,16.3 10.33,15.6 v10.63,15.9
  other vias: 3.43,34.3 12.03,19 13.43,15.3 4.73,18.6 2.63,5.3 12.13,23.4 3.43,16.3 1.73,14 6.33,27.6 19.73,29.4
  pour Top (isolate 0.254, rank 3, no thermals): -1.47,0.1 -1.47,36.9 45.07,36.8 45.07,0
  pour Bottom (isolate 0.254, no thermals): 44.95,0 44.95,36.8 -1.47,36.8 -1.47,0
  pour Route15 (isolate 0.254, no thermals): 44.95,0 44.95,36.8 -1.47,36.8 -1.47,0
MCLR
  Top 0.203: R1.1 30.51,11.26 C17.1 30.43,11.3 29.93,11.3 29.83,11.2 29.13,11.2 | R2.1 29.09,11.23 29.13,11.2 | 29.13,11.2 28.93,11.2
  Top 0.305: R2.1 28.88,7.75 25.53,4.4 JP6.1
MISO  (via drill 0.3)
  Top 0.203: U$1.9 30.3,17.66 v30.43,17.79
  Bottom 0.203: X1.4 29.22,27.05 28.95,26.78 27.31,26.78 26.93,26.4 26.93,23.3 30.43,19.8 v30.43,17.79
MOSI  (via drill 0.3)
  Top 0.203: U$1.72 28.29,26.08 v27.71,25.5
  Bottom 0.203: X1.6 29.81,28.61 29.81,26.71 28.64,25.5 v27.71,25.5
N$1
  Top 0.203: U$1.63 31.89,31.07 31.51,31.46 31.51,33.28 U$2.3 34.73,34.8 C1.1
N$2
  Top 0.203: U$1.64 31.49,30.54 30.03,32 29.43,32 U$2.1 28.73,32.7 C2.2
N$4
  Top 0.203: U$1.85 22.22,23.69 21.66,23.13 C8.2
N$8
  Top 0.203: C3.1 3.43,13.95 U$3.3 4.18,14.7 8.23,14.7 9.38,15.85 IC1.3
N$9
  Top 0.203: IC1.2 8.88,16.05 8.03,15.2 4.33,15.2 4.23,15.1 2.53,15.1 2.13,15.5 2.13,15.85 U$3.1 1.78,17.75 C4.2
N$10
  Top 0.203: IC1.7 USB1.P2
N$11
  Top 0.203: IC1.8 11.88,7.15 12.03,7 USB1.P3
N$12  (via drill 0.3)
  Top 0.203: 1.43,29.9 v1.53,30 1.55,29.98 IC2.1 | R4.1 3.68,19.75 IC1.63 9.18,19.75 10.53,21.1 v10.53,21.5
  Bottom 0.203: v10.53,21.5 10.53,28.5 9.03,30 v1.53,30
N$13  (via drill 0.3)
  Top 0.203: IC2.2 2.21,29.07 v2.23,29.1 | R5.1 3.73,20.8 4.13,20.8 4.68,20.25 IC1.62 8.48,20.25 9.33,21.1 v9.33,21.5
  Bottom 0.203: v9.33,21.5 9.33,27.9 8.13,29.1 v2.23,29.1
N$14
  Top 0.203: U$1.13 31.89,13.27 R1.2
N$15
  Top 0.203: U$1.26 40.43,17.69 LED1.1
N$16
  Top 0.203: LED1.2 42.98,14.97 R3.1
N$17
  Top 0.203: 3.4,24.23 R7.1 | R6.1 R7.1 | IC2.4 3.5,24.27 R7.1
N$18  (via drill 0.3)
  Top 0.203: IC1.61 7.78,20.75 8.13,21.1 v8.13,21.5 | v2.93,28.3 2.85,28.23 IC2.3 2.85,25.43 R7.2
  Bottom 0.203: v8.13,21.5 8.13,27.6 7.43,28.3 v2.93,28.3
N$19
  Top 0.203: IC1.14 14.88,15.45 R8.1
N$20  (via drill 0.3)
  Top 0.203: IC1.6 10.88,18.95 v10.83,19
  Bottom 0.203: v10.83,19 9.33,19 R9.1
  other vias: 6.83,16.5
N$21
  Top 0.254: IC1.4 9.88,13.25 C22.A C24.1 9.78,11.15 L2.1
N$22
  Top 0.254: IC1.9 12.38,14.25 C21.A C23.1 13.48,11.05 L1.1
N$23
  Top 0.406: U1.1 1.67,1.83 C7.2
N$25
  Top 0.025: 24.58,7.83 24.58,9.38
N$28
  Top 0.203: IC1.54 4.88,24.25 4.73,24.4 4.73,27.7 4.53,27.9 4.53,31.2 4.83,31.5 4.83,32.8 5.53,33.5 8.33,33.5 R10.2 8.43,33.4
N$29
  Top 0.203: IC1.55 4.58,23.75 4.23,24.1 4.23,27.4 4.03,27.6 4.03,31.4 4.23,31.6 4.23,34.1 5.03,34.9 8.43,34.9 R11.2
N$32
  Top 0.203: LED2.C R10.1
N$33
  Top 0.203: LED3.C R11.1
PGC
  Top 0.203: U$1.24 36.29,3.12 JP6.5
PGD  (via drill 0.3)
  Top 0.203: U$1.25 36.7,14.53 v37.33,13.9
  Bottom 0.305: v37.33,13.9 37.33,9 33.13,4.8 33.13,2.29 JP6.4
RD*
  Top 0.203: U$1.82 19.63,24.88 19.5,24.75 IC1.28
SCK  (via drill 0.3)
  Top 0.203: U$1.70 29.1,27.38 v30.98,25.5
  Bottom 0.203: X1.10 31.09,25.62 v30.98,25.5
SCL  (via drill 0.3)
  Top 0.203: U$1.58 33.9,26.34 v33.91,25.5
  Bottom 0.203: X1.16 33,27 33.28,26.75 33.28,26.13 v33.91,25.5
SDA  (via drill 0.3)
  Top 0.203: U$1.59 33.49,26.43 v32.56,25.5
  Bottom 0.203: X1.14 32.37,25.66 v32.56,25.5
SS  (via drill 0.3)
  Top 0.203: v29.55,18.41 29.55,17.53 29.88,17.2 U$1.8 | v29.73,25.5 29.73,24.65 v31.39,22.99
  Route14 0.203: v31.39,22.99 31.39,20.25 v29.55,18.41
  Bottom 0.203: X1.8 30.46,26.24 v29.73,25.5
U1RX  (via drill 0.3)
  Top 0.203: v36.69,25.5 36.69,26.66 36.29,27.06 U$1.52
  Bottom 0.203: X1.22 34.91,26.89 36.32,25.5 v36.69,25.5
U1TX  (via drill 0.3)
  Top 0.203: U$1.53 35.88,26.11 v35.27,25.5
  Bottom 0.203: X1.20 34.28,26.48 v35.27,25.5
U3RX  (via drill 0.3)
  Top 0.203: U$1.49 39.99,26.89 v40.26,27.16
  Bottom 0.203: v40.26,27.16 v40.26,27.15 40.01,26.9 37.18,26.9 36.87,27.23 36.86,28.63 X1.28
U3TX  (via drill 0.3)
  Top 0.203: U$1.50 39.23,28.03 41.11,28.03 41.37,27.77 v41.37,27.16
  Bottom 0.203: X1.26 36.17,27.16 37.32,26.06 41.05,26.06 41.37,26.38 v41.37,27.16
USB_UART_RX  (via drill 0.3)
  Top 0.203: v12.53,26.9 12.57,26.9 12.88,27.21 IC1.39 | v32.33,18.8 32.33,18.13 31.48,17.28 U$1.12
  Route15 0.203: v12.53,26.9 23.83,26.9 31.53,19.2 31.93,19.2 v32.33,18.8
USB_UART_TX  (via drill 0.3)
  Top 0.203: 13.37,26.25 13.43,26.19 v13.43,26.1 13.38,26.15 IC1.38 | v31.27,18.36 31.27,17.89 31.11,17.73 U$1.11
  Route15 0.203: v13.43,26.1 23.73,26.1 30.93,18.9 30.93,18.7 v31.27,18.36
VCC1V8_D
  Top 0.203: IC1.12 13.88,19.85 12.13,21.6 | 11.03,26.3 10.88,26.45 | 12.13,25.2 11.73,25.6 | IC1.64 9.78,19.25 12.13,21.6 | 12.13,21.6 13.83,23.3 13.83,24.9 | IC1.37 13.88,30.75 C20.A
  Top 0.254: IC1.49 10.58,26.75 10.88,26.45 11.73,25.6 12.43,24.9 13.83,24.9 13.93,24.9 14.43,25.4 14.43,26.84 13.87,27.4 IC1.37
VDD3V3_D  (via drill 0.3)
  Top 0.203: U$1.86 23.01,23.28 22.73,23 22.73,21.65 C10.2 v23.23,21.7 | U$1.30 40.49,19.3 C16.2 v40.53,19.3 | U$1.37 40.49,22.09 C15.2 40.53,22.51 v40.52,22.54 | U$1.46 40.5,25.7 C14.2 40.53,25.28 v40.56,25.24 | U$1.16 33.09,13.93 C12.2 | U$1.2 27.5,13.23 C11.2 27.31,13.04 R2.2 | U$1.62 32.3,30.97 32.73,31.4 35.43,31.4 C9.2 | U$1.55 35.09,30.07 37.03,32 37.63,32 C13.2 | IC2.8 1.63,32.5 C5.1 | R6.2 R5.2 R4.2 | IC1.20 19.28,20.75 C26.2 | IC1.31 19.68,26.25 C28.2 20.63,26.3 21.03,26.7 v21.03,28.5 | IC1.50 5.58,26.25 5.23,26.6 5.23,29.7 C27.2 v6.23,30.9 | IC1.42 11.38,30.65 C25.2 v11.33,30.9 | IC1.56 5.18,23.25 4.83,22.9 v4.83,21.9 | v16.73,15.5 R8.2
  Top 0.305: v40.53,33.1 40.14,32.71 C13.2 C9.2
  Top 0.406: U1.6 U1.5 3.6,9.54 C19.2 | R2.2 v28.88,13.06 | v33.93,13.1 C12.2 | L2.2 v8.03,9.5 | v15.23,9.5 L1.2 | v14.13,33 LED2.A | LED3.A v14.13,34.5
  Bottom 0.305: X1.5 29.82,31.32 v29.63,31.1
  other vias: 3.43,9.7 19.73,20.5 1.63,34.3 1.63,21.1
  pour Route14 (isolate 0.254, no thermals): 44.95,0 44.95,36.8 -1.47,36.8 -1.47,0
VDD5V0_D  (via drill 0.3)
  Top 0.406: USB1.P1 10.73,6.6 9.93,7.4 7.73,7.4 6.63,6.3 v6.63,5.3 C6.2 5.63,5.2 | 5.63,5.2 4.83,4.4 C18.1 3.88,3.8 U1.4 | U1.8 1.67,6.76 2.03,6.4 4.43,6.4 5.63,5.2
  Route14 0.406: 6.63,5.4 v6.63,5.3
  Route14 0.61: 6.63,5.4 41.23,5.4 42.83,7 42.83,34.6 v42.23,35.2
  Bottom 0.305: v42.23,35.2 29.43,35.2 29.19,35 29.23,33.36 X1.3
WR*
  Top 0.203: IC1.29 19.19,25.25 19.23,25.29 U$1.81
(copper drawn outside any net)
  shapes: Top area x730

### Text on the board
tNames: SEAD DAQ Unit v2.0b / (c) Pavlo Manovi - 2014 / sead.systems / pavlo.me | ICSP | MCLR